# EAGLE design forkbomb19 (EAGLE 9.4.2)
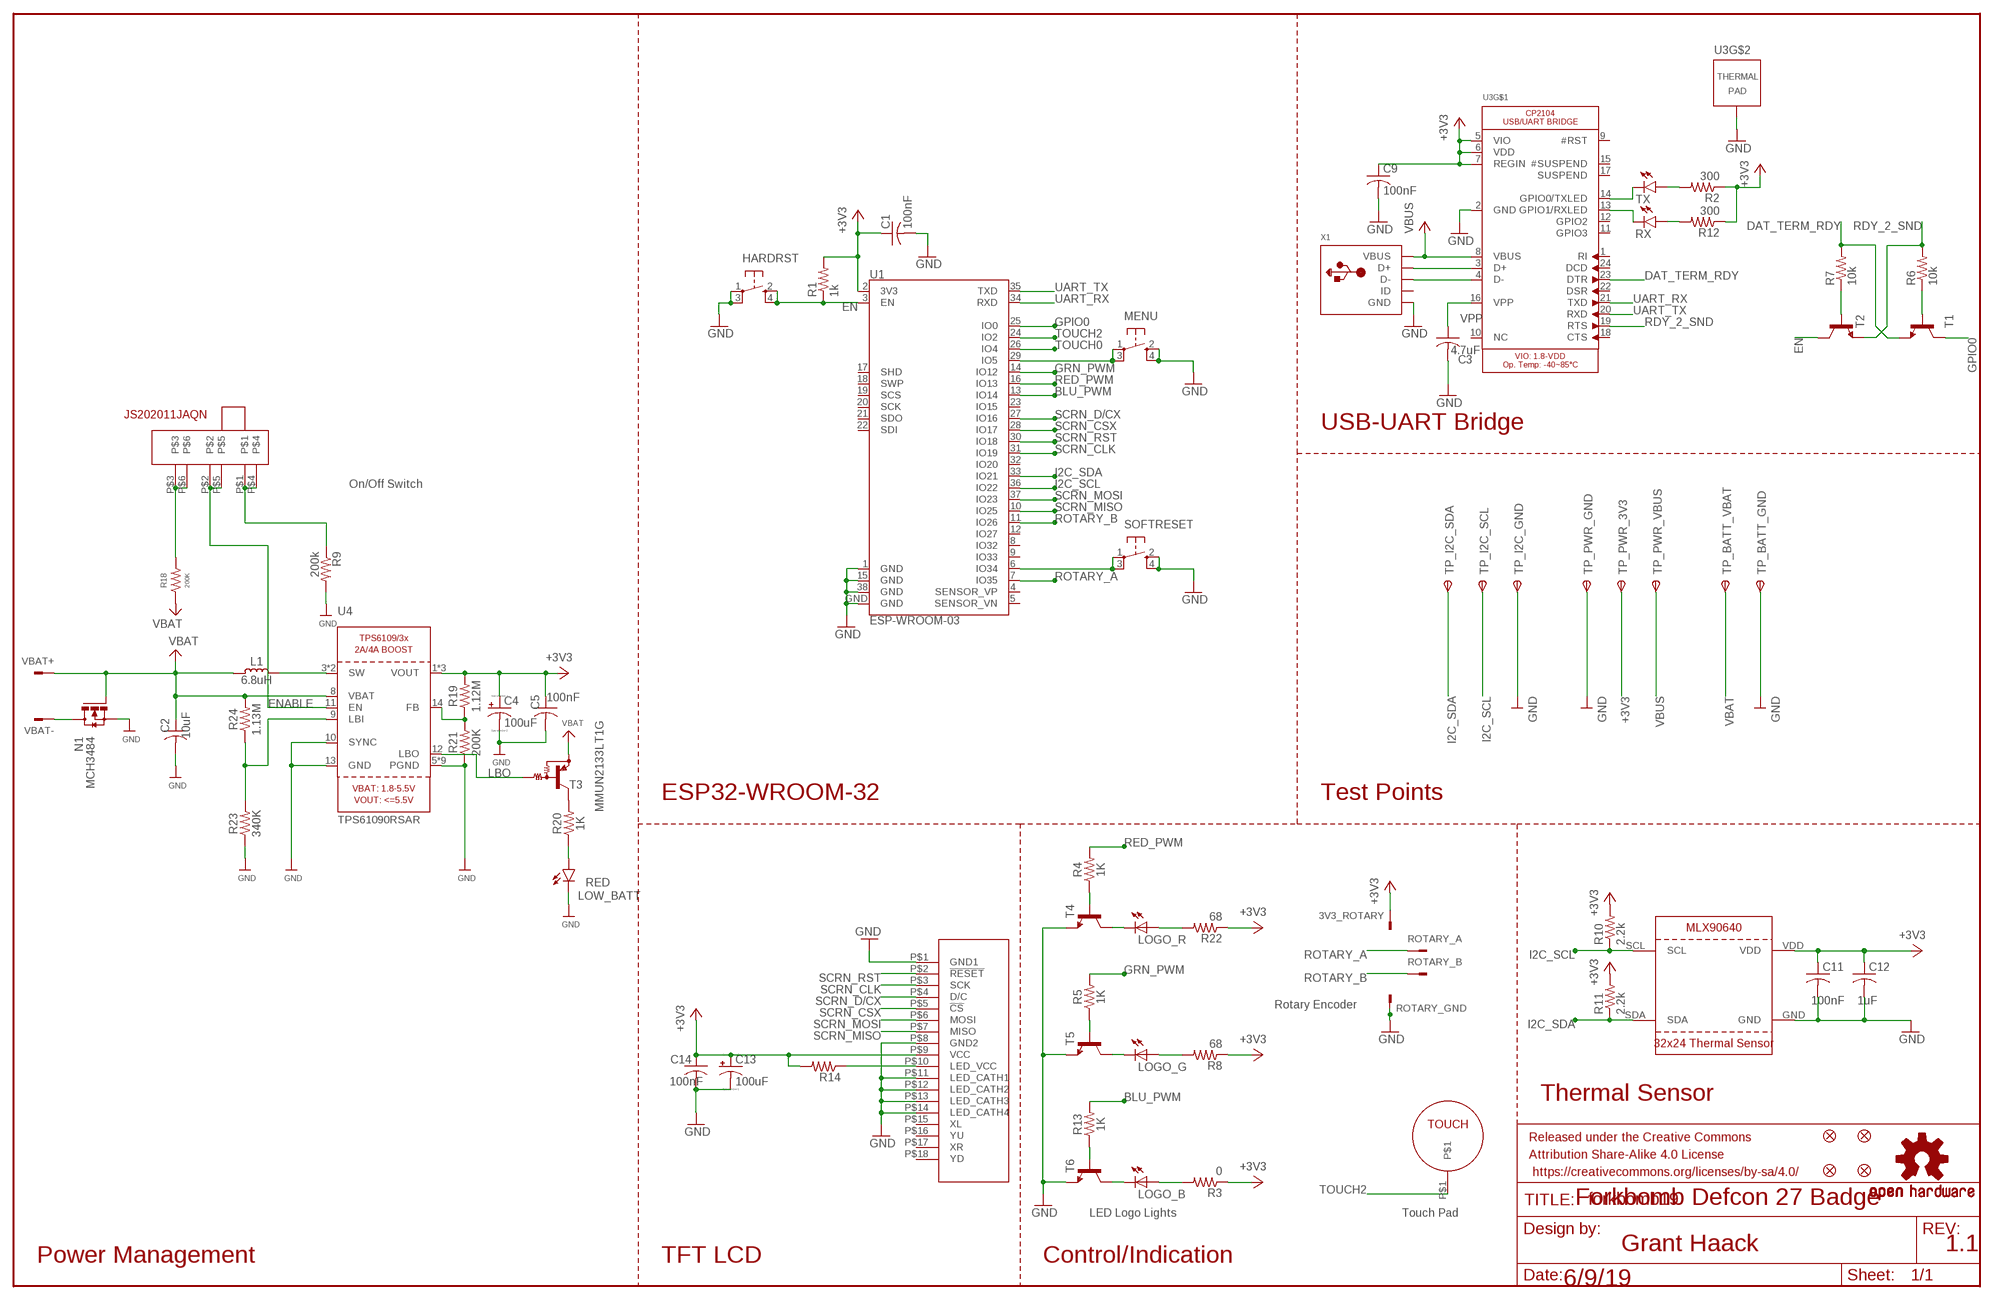
[diagram p0: schematic, sheet 1]

## Parts
3V3_ROTARY  POT_GND  TSW-101-07-G-S  [TSW-101-XX-G-S]
C1  100nF  C-USC0603  [C0603]
C2  10uF  C-USC1210  [C1210]
C3  4.7uF  C-USC0805  [C0805]
C4  100uF  CPOL-USC/6032-28R  [C/6032-28R]
C5  100nF  C-USC0603  [C0603]
C9  100nF  C-USC0603  [C0603]
C11  100nF  C-USC0603  [C0603]
C12  1uF  C-USC0805  [C0805]
C13  100uF  CPOL-USC/6032-28R  [C/6032-28R]
C14  100nF  C-USC0603  [C0603]
FID1  FIDUCIAL_1MM  [FIDUCIAL_1MM]
FID2  FIDUCIAL_1MM  [FIDUCIAL_1MM]
FID3  FIDUCIAL_1MM  [FIDUCIAL_1MM]
FID4  FIDUCIAL_1MM  [FIDUCIAL_1MM]
FRAME1  FRAME-LEDGER  [CREATIVE_COMMONS]
HARDRST  SPST_TACT-KMR2  [KMR2]
L1  6.8uH  INDUCTORTDK_VLC5045  [INDUCTOR_5X5MM_TDK_VLC5045]
LOGO1  OSHW-LOGOS-COPPER  [OSHW-LOGO-S_COPPER]
LOGO_B  REVERSE_PLCC_LED  [PLCC2_LED]
LOGO_G  REVERSE_PLCC_LED  [PLCC2_LED]
LOGO_R  REVERSE_PLCC_LED  [PLCC2_LED]
LOW_BATT  RED  LEDCHIP-LED0603  [CHIP-LED0603]
MENU  SPST_TACT-KMR2  [KMR2]
N1  MCH3484  [MCH3484]
R1  1k  R-US_R0603  [R0603]
R2  300  R-US_R0603  [R0603]
R3  0  R-US_R0805  [R0805]
R4  1K  R-US_R0603  [R0603]
R5  1K  R-US_R0603  [R0603]
R6  10k  R-US_R0603  [R0603]
R7  10k  R-US_R0603  [R0603]
R8  68  R-US_R0805  [R0805]
R9  200k  R-US_R0603  [R0603]
R10  2.2k  R-US_R0603  [R0603]
R11  2.2k  R-US_R0603  [R0603]
R12  300  R-US_R0603  [R0603]
R13  1K  R-US_R0603  [R0603]
R14  R-US_R1210  [R1210]
R18  200K  R-US_R0603  [R0603]
R19  1.12M  R-US_R0603  [R0603]
R20  1K  R-US_R0603  [R0603]
R21  200K  R-US_R0603  [R0603]
R22  68  R-US_R0805  [R0805]
R23  340K  R-US_R0603  [R0603]
R24  1.13M  R-US_R0603  [R0603]
ROTARY_A  POT_SIG  TSW-101-07-G-S  [TSW-101-XX-G-S]
ROTARY_B  POT_3V3  TSW-101-07-G-S  [TSW-101-XX-G-S]
ROTARY_GND  POT_GND  TSW-101-07-G-S  [TSW-101-XX-G-S]
RX  LEDCHIP-LED0603  [CHIP-LED0603]
SOFTRESET  SPST_TACT-KMR2  [KMR2]
T1  MMBT3904LT1-NPN-SOT23-BEC  [SOT23-BEC]
T2  MMBT3904LT1-NPN-SOT23-BEC  [SOT23-BEC]
T3  MMUN2133LT1G  MUN2114T1-PNP_DRIVER-SC59-BEC  [SC59-BEC]
T4  MMBT3904LT1-NPN-SOT23-BEC  [SOT23-BEC]
T5  MMBT3904LT1-NPN-SOT23-BEC  [SOT23-BEC]
T6  MMBT3904LT1-NPN-SOT23-BEC  [SOT23-BEC]
TOUCH  TOUCHPADTOUCH_BLANK  [TOUCH_BLANK]
TP_BATT_GND  TPSTP20SQ  [TP20SQ]
TP_BATT_VBAT  TPSTP20SQ  [TP20SQ]
TP_I2C_GND  TPSTP20SQ  [TP20SQ]
TP_I2C_SCL  TPSTP20SQ  [TP20SQ]
TP_I2C_SDA  TPSTP20SQ  [TP20SQ]
TP_PWR_3V3  TPSTP20SQ  [TP20SQ]
TP_PWR_GND  TPSTP20SQ  [TP20SQ]
TP_PWR_VBUS  TPSTP20SQ  [TP20SQ]
TX  LEDCHIP-LED0603  [CHIP-LED0603]
U1  ESP-WROOM-03  [ESP-WROOM-03]
U3  CP2104  [QFN24_4MM_SMSC]
U4  TPS61090RSAR  VREG_TPS6103X  [PVQFN-16]
U$2  SPI_TFT  [SPI_TFT]
U$7  MLX90640  [MLX90640]
U$8  JS202011JAQN  [JS202011JAQN]
VBAT+  POT_GND  TSW-101-07-G-S  [TSW-101-XX-G-S]
VBAT-  POT_GND  TSW-101-07-G-S  [TSW-101-XX-G-S]
X1  USB_MICRO_20329_V2  [4UCONN_20329_V2]

## Nets
+3V3: 3V3_ROTARY.1 C1.1 C4.+ C5.1 C9.1 C11.1 C12.1 C13.+ C14.1 R1.2 R2.1 R3.1 R8.1 R10.2 R11.2 R12.1 R14.2 R19.2 R22.1 TP_PWR_3V3.TP(PP) U1.2(3V3) U3.5(VIO) U3.6(VDD) U3.7(REGIN) U4.1(VOUT) U4.15(VOUT) U4.16(VOUT) U$2.P$9(VCC) U$7.VDD
BLU_PWM: R13.2 U1.13(IO14)
DAT_TERM_RDY: R7.2 T1.E U3.23(DTR)
EN: HARDRST.2(S) HARDRST.4(S1) R1.1 T2.C U1.3(EN)
ENABLE: U4.11(EN) U$8.P$2 U$8.P$5
GND: C1.2 C2.2 C3.2 C4.- C5.2 C9.2 C11.2 C12.2 C13.- C14.2 HARDRST.1(P) HARDRST.3(P1) LOW_BATT.C MENU.2(S) MENU.4(S1) N1.S R9.2 R21.1 R23.1 ROTARY_GND.1 SOFTRESET.2(S) SOFTRESET.4(S1) T4.E T5.E T6.E TP_BATT_GND.TP(PP) TP_I2C_GND.TP(PP) TP_PWR_GND.TP(PP) U1.1(GND) U1.15(GND) U1.38(GND) U1.GND U3.2(GND) U3.THERM(TP) U4.5(PGND) U4.6(PGND) U4.7(PGND) U4.10(SYNC) U4.13(GND) U4.P$18(PGND) U4.P$19(PGND) U4.P$20(PGND) U4.P$21(PGND) U4.P$22(PGND) U4.THERMAL(PGND) U$2.P$1(GND1) U$2.P$8(GND2) U$2.P$11(LED_CATH1) U$2.P$12(LED_CATH2) U$2.P$13(LED_CATH3) U$2.P$14(LED_CATH4) U$7.GND X1.BASE@1(GND) X1.BASE@2(GND) X1.GND X1.SPRT@1(GND) X1.SPRT@2(GND) X1.SPRT@3(GND) X1.SPRT@4(GND)
GPIO0: T1.C U1.25(IO0)
GRN_PWM: R5.2 U1.14(IO12)
I2C_SCL: R10.1 TP_I2C_SCL.TP(PP) U1.36(IO22) U$7.SCL
I2C_SDA: R11.1 TP_I2C_SDA.TP(PP) U1.33(IO21) U$7.SDA
LBO: T3.B U4.12(LBO)
MENU: MENU.1(P) MENU.3(P1) U1.29(IO5)
N$1: R14.1 U$2.P$10(LED_VCC)
N$2: SOFTRESET.1(P) SOFTRESET.3(P1) U1.6(IO34)
N$3: R18.2 U$8.P$3 U$8.P$6
N$4: LOGO_B.2(C) T6.C
N$5: U3.3(D+) X1.D+
N$6: U3.4(D-) X1.D-
N$7: LOGO_B.1(A) R3.2
N$8: LOGO_G.2(C) T5.C
N$9: LOGO_R.2(C) T4.C
N$10: R5.1 T5.B
N$11: R13.1 T6.B
N$12: LOGO_R.1(A) R22.2
N$13: R9.1 U$8.P$1 U$8.P$4
N$14: R4.1 T4.B
N$15: R7.1 T2.B
N$16: L1.P$2 U4.3(SW) U4.4(SW)
N$17: R6.1 T1.B
N$18: N1.D VBAT-.1
N$19: RX.C U3.13(GPIO1/RXLED)
N$20: TX.C U3.14(GPIO0/TXLED)
N$21: R2.2 TX.A
N$22: R12.2 RX.A
N$23: R23.2 R24.1 U4.9(LBI)
N$24: LOW_BATT.A R20.1
N$25: R19.1 R21.2 U4.14(FB)
N$26: R20.2 T3.C
N$31: LOGO_G.1(A) R8.2
RDY_2_SND: R6.2 T2.E U3.19(RTS)
RED_PWM: R4.2 U1.16(IO13)
ROTARY_A: ROTARY_A.1 U1.7(IO35)
ROTARY_B: ROTARY_B.1 U1.11(IO26)
SCRN_CLK: U1.31(IO19) U$2.P$3(SCK)
SCRN_CSX: U1.28(IO17) U$2.P$5(!CS)
SCRN_D/CX: U1.27(IO16) U$2.P$4(D/C)
SCRN_MISO: U1.10(IO25) U$2.P$7(MISO)
SCRN_MOSI: U1.37(IO23) U$2.P$6(MOSI)
SCRN_RST: U1.30(IO18) U$2.P$2(!RESET)
TOUCH0: U1.26(IO4)
TOUCH2: TOUCH.P$1 U1.24(IO2)
UART_RX: U1.34(RXD) U3.21(TXD)
UART_TX: U1.35(TXD) U3.20(RXD)
VBAT: C2.1 L1.P$1 N1.G R18.1 R24.2 T3.E TP_BATT_VBAT.TP(PP) U4.8(VBAT) VBAT+.1
VBUS: TP_PWR_VBUS.TP(PP) U3.8(VBUS) X1.VBUS
VPP: C3.1 U3.16(VPP)
Unconnected: U1.4(SENSOR_VP) U1.5(SENSOR_VN) U1.8(IO32) U1.9(IO33) U1.12(IO27) U1.17(SHD) U1.18(SWP) U1.19(SCS) U1.20(SCK) U1.21(SDO) U1.22(SDI) U1.23(IO15) U1.32(IO20) U3.1(RI) U3.9(#RST) U3.10(NC) U3.11(GPIO3) U3.12(GPIO2) U3.15(#SUSPEND) U3.17(SUSPEND) U3.18(CTS) U3.22(DSR) U3.24(DCD) U$2.P$15(XL) U$2.P$16(YU) U$2.P$17(XR) U$2.P$18(YD) X1.ID

## Notes on the sheet
- USB-UART Bridge
- On/Off Switch
- ESP32-WROOM-32 | Test Points
- Rotary Encoder
- Thermal Sensor
- Forkbomb Defcon 27 Badge
- LED Logo Lights | Touch Pad
- Grant Haack | 1.1
- Power Management | TFT LCD | Control/Indication
- 6/9/19

## Library data of the parts
3V3_ROTARY ROTARY_A ROTARY_B ROTARY_GND VBAT+ VBAT- = con-samtec:TSW-101-*-G-S: THROUGH-HOLE .025" SQ POST HEADER Source: Samtec TSW.pdf; MF: Samtec Inc.; MPN: TSW-101-07-G-S
C1 C9 C11 C12 C14 = resistor:C-US: CAPACITOR, American symbol
C2 C3 C5 = rcl:C-US: CAPACITOR, American symbol; SPICEPREFIX: C
C4 C13 = resistor:CPOL-US: POLARIZED CAPACITOR, American symbol
FID1-FID4 = forkbomb19:FIDUCIAL: Fiducial Alignment Points Various fiducial points for machine vision alignment.; BOM: EXCLUDE
FRAME1 = SparkFun-Aesthetics:FRAME-LEDGER: Schematic Frame - Ledger Standard 11x14 US Ledger frame
HARDRST MENU SOFTRESET = adafruit:SPST_TACT: SMT 6mm switch, EVQQ2 series http://www.ladyada.net/library/eagle
L1 = microbuilder:INDUCTOR: Inductors 0603: 10nH Ceramic Inductor - microwire antenna/RF (Digikey: 712-1434-2-ND) 0805: 560nH Ceramic Inductor - RF (Digikey: 553-1047-1-ND) 270nH Ceramic Inductor - Q = 40@250MHz, +-5%, 1 Ohm DC Resistance (Digikey: 535-10506-2-ND) 1007 (2518 Metric) SMT: 10µH 10% 250mOhm 820mA 1007 Inductor (Digikey: 587-2189-1-ND) 22µH 10% 500mOhm 580mA 1007 Inductor (Digikey: 587-2190-1-ND) 47µH 10% 950mOhm 420mA 1007 Inductor (Digikey: 587-2191-1-ND) 47µH 5% 100mOhm 1A 1008 Inductor (Digikey: 732-1816-1-ND) 5.0x5.0mm (Taiyo Yuden NR5040 Series) 6.8µH 20% 2.3A 64mOhm Inductor (Digikey: 587-2374-2-ND) 5.0x5.0mm (TDK VLC5045 Series) 4.7µH 20% 3.3A 34mOhm Inductor (Digikey: 445-6526-1-ND) 6.8µH 20% 2.7A 46mOhm Inductor (Digikey: 445-6527-1-ND) 6.0x6.0mm (TDK VLC6045 Series) 4.7µH 20% 3.8A 27mOhm Inductor (Digikey: 445-6538-2-ND) 6.8µH 20% 3A 41mOhm Inductor (Digikey: 445-6540-1-ND) 6.2µH 30% 2.2A 45mOhm Inductor (Digikey: SRR5028-6R2YCT-ND) - Not TDK VLC6045 but footprint should match 6.0x6.0mm (TDK SLF6045 Series) 6.8uH 30% 2A 33mOhm Inductor (Digikey: 445-4572-1-ND, Mouser: 810-SLF645T6R8N2R0PF) 6.0x6.0mm (Sumida CDRH5D28 Series) 6.2uH 30% 1.8A 45mOhm Inductor (Digikey: 308-1542-1-ND) Taiyo Yuden NR3015T2R2M - 2.2uH 20% 1.5A (Digikey: 587-1648-2-ND, Mouser: 963-NR3015T2R2M) - Used with TI TPS62172 CoilCraft RFID Transponder Coil - MA5532-AE (For use with AS3935 Lightning Sensor) Vishay IHLP 1.0uH Molded Inductor - 24mOhm DCR, 5A, +/-20%, -55°C-125°C (Digikey: 541-1319-1-ND)
LOGO1 = SparkFun-Aesthetics:OSHW-LOGO: Open-Source Hardware (OSHW) Logo This logo indicates the piece of hardware it is found on incorporates a OSHW license and/or adheres to the definition of open source hardware found here: http://freedomdefined.org/OSHW
LOGO_B LOGO_G LOGO_R = forkbomb19:REVERSE_PLCC_LED
LOW_BATT RX TX = led:LED: LED OSRAM: - CHIPLED LG R971, LG N971, LY N971, LG Q971, LY Q971, LO R971, LY R971 LH N974, LH R974 LS Q976, LO Q976, LY Q976 LO Q996 - Hyper CHIPLED LW Q18S LB Q993, LB Q99A, LB R99A - SideLED LS A670, LO A670, LY A670, LG A670, LP A670 LB A673, LV A673, LT A673, LW A673 LH A674 LY A675 LS A676, LA A676, LO A676, LY A676, LW A676 LS A679, LY A679, LG A679 - Hyper Micro SIDELED® LS Y876, LA Y876, LO Y876, LY Y876 LT Y87S - SmartLED LW L88C, LW L88S LB L89C, LB L89S, LG L890 LS L89K, LO L89K, LY L89K LS L896, LA L896, LO L896, LY L896 - TOPLED LS T670, LO T670, LY T670, LG T670, LP T670 LSG T670, LSP T670, LSY T670, LOP T670, LYG T670 LG T671, LOG T671, LSG T671 LB T673, LV T673, LT T673, LW T673 LH T674 LS T676, LA T676, LO T676, LY T676, LB T676, LH T676, LSB T676, LW T676 LB T67C, LV T67C, LT T67C, LS T67K, LO T67K, LY T67K, LW E67C LS E67B, LA E67B, LO E67B, LY E67B, LB E67C, LV E67C, LT E67C LW T67C LS T679, LY T679, LG T679 LS T770, LO T770, LY T770, LG T770, LP T770 LB T773, LV T773, LT T773, LW T773 LH T774 LS E675, LA E675, LY E675, LS T675 LS T776, LA T776, LO T776, LY T776, LB T776 LHGB T686 LT T68C, LB T68C - Hyper Mini TOPLED® LB M676 - Mini TOPLED Santana® LG M470 LS M47K, LO M47K, LY M47K Source: http://www.osram.convergy.de LUXEON: - LUMILED® LXK2-PW12-R00, LXK2-PW12-S00, LXK2-PW14-U00, LXK2-PW14-V00 LXK2-PM12-R00, LXK2-PM12-S00, LXK2-PM14-U00 LXK2-PE12-Q00, LXK2-PE12-R00, LXK2-PE12-S00, LXK2-PE14-T00, LXK2-PE14-U00 LXK2-PB12-K00, LXK2-PB12-L00, LXK2-PB12-M00, LXK2-PB14-N00, LXK2-PB14-P00, LXK2-PB14-Q00 LXK2-PR12-L00, LXK2-PR12-M00, LXK2-PR14-Q00, LXK2-PR14-R00 LXK2-PD12-Q00, LXK2-PD12-R00, LXK2-PD12-S00 LXK2-PH12-R00, LXK2-PH12-S00 LXK2-PL12-P00, LXK2-PL12-Q00, LXK2-PL12-R00 Source: www.luxeon.com KINGBRIGHT: KA-3528ASYC Source: www.kingbright.com
N1 = forkbomb19:MCH3484
R1-R3 R6-R8 R10-R12 R22 = resistor:R-US_: RESISTOR, American symbol
R4 R5 R9 R13 R14 R18-R21 R23 R24 = rcl:R-US_: RESISTOR, American symbol; SPICEPREFIX: R
T1 T2 T4-T6 = transistor:*-NPN-: NPN Transistror BF959 corrected 2008.03.06
T3 = transistor:*-PNP_DRIVER-: PNP Bias Resistor Transistor
TOUCH = forkbomb19:TOUCHPAD
TP_BATT_GND TP_BATT_VBAT TP_I2C_GND TP_I2C_SCL TP_I2C_SDA TP_PWR_3V3 TP_PWR_GND TP_PWR_VBUS = testpad:TPS: TEST PIN
U1 = forkbomb19:ESP-WROOM-03
U3 = forkbomb19:CP2104: CP2104 - USB to UART Bridge VDD Output: 3.45V
U4 = microbuilder:VREG_TPS6103X: TPS6103x 4A Boost - 1.8-5.5V Input, Adjustable Output to 5.5V
U$2 = forkbomb19:SPI_TFT
U$7 = forkbomb19:MLX90640
U$8 = forkbomb19:JS202011JAQN
X1 = forkbomb19:USB: USB Connectors USBMINIB - Surface Mount Female Mini-B USB Connector 4UConnector: 06564

## Board
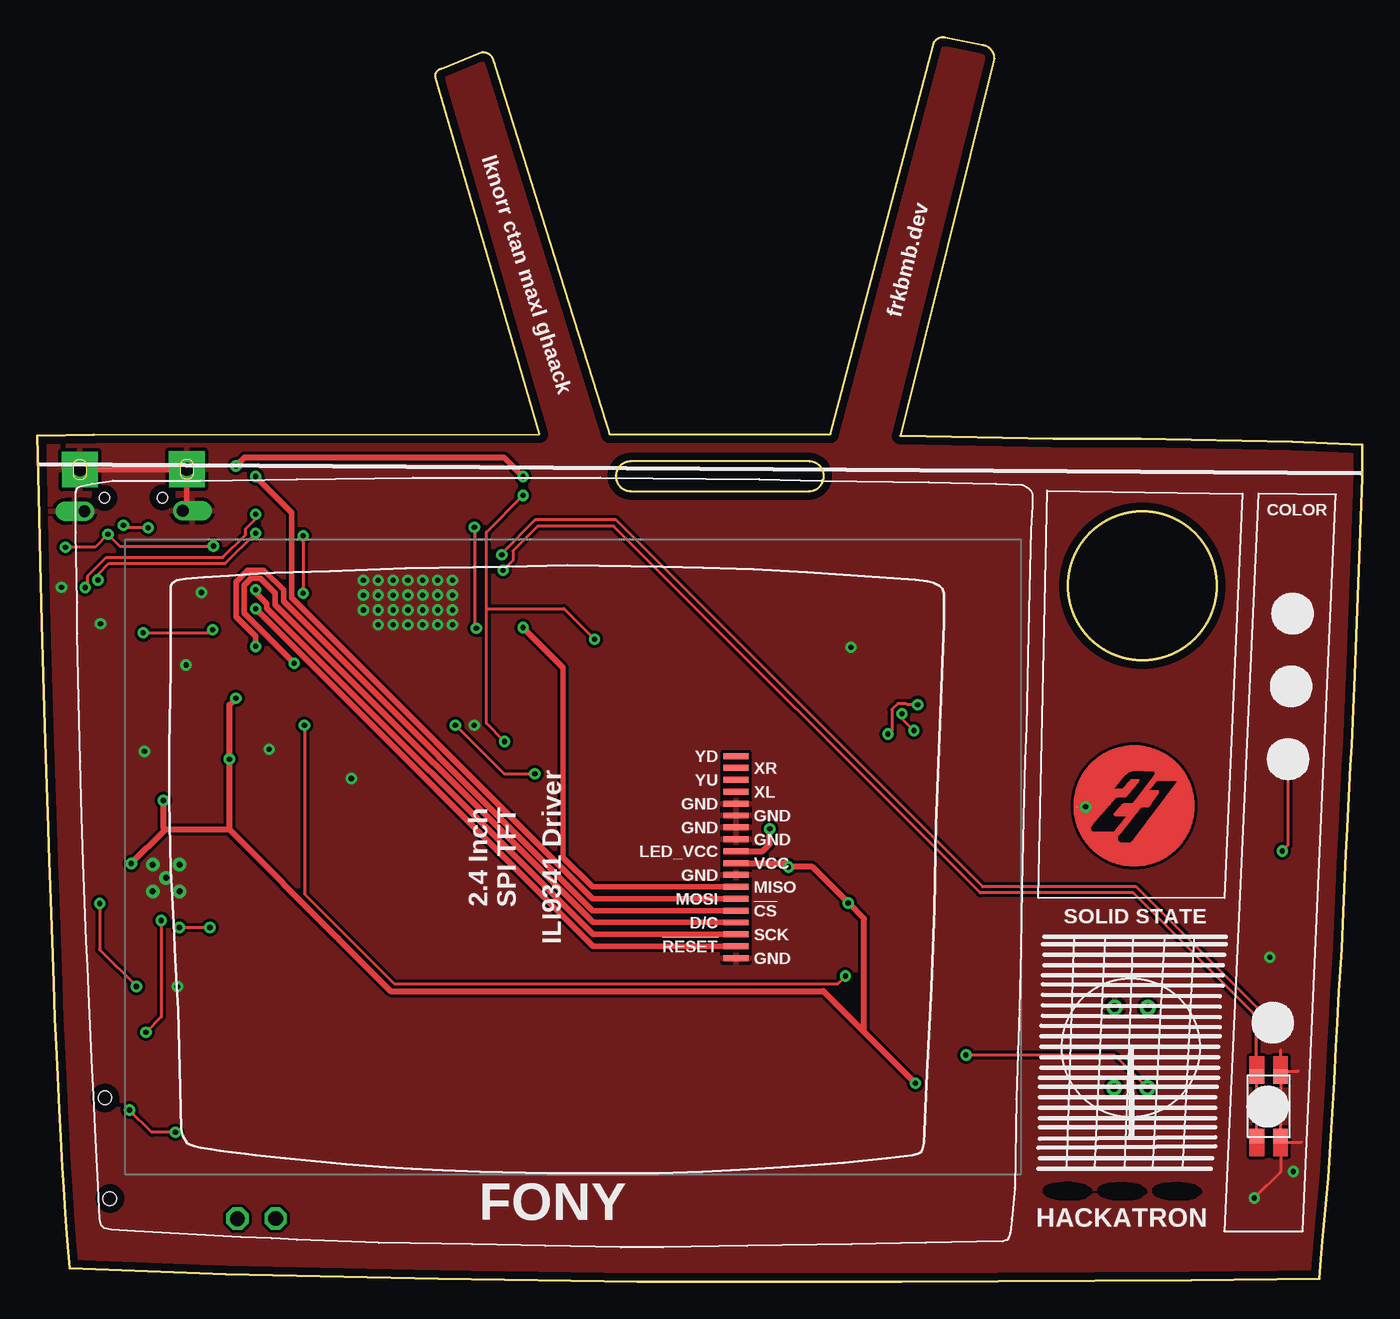
[diagram p1: board, top side]
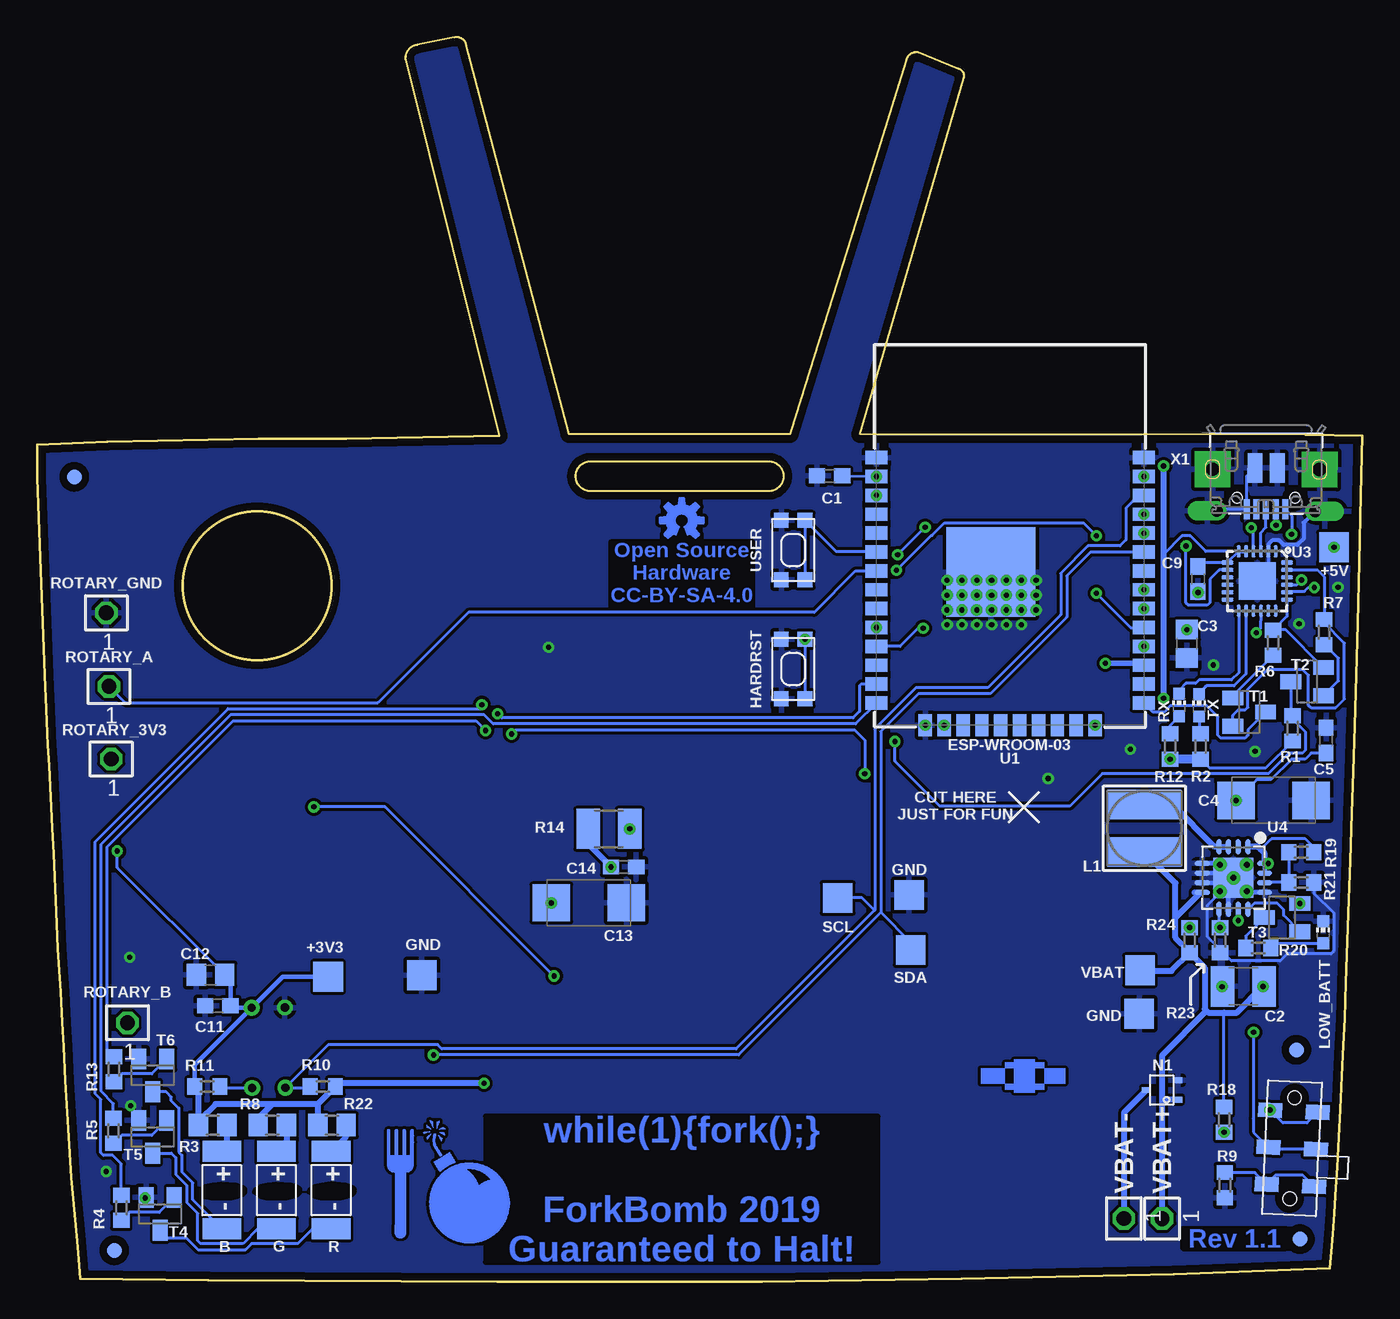
[diagram p2: board, bottom side, seen from below]

Size 89.2 x 83.73 mm. Coordinates in mm from the lower left corner, seen from the top.
Outline: 2.2,0.9 2.1,2 2,3.2 1.9,4.6 1.8,6.3 1.7,7.7 1.6,9.7 1.5,11.6 1.4,13.8 1.3,15.9 1.2,17.7 1.1,20.1 0.9,25.7 0.8,28.3 0.7,31.5 0.6,34.3 0.5,37.4 0.4,40.8 0.3,44.3 0.2,48.4 0.1,52.9 0,56.9 3.81,56.97 33.81,57.02 26.81,81.02 arc-90 27.21,81.62 29.91,82.72 arc-90 30.71,82.12 38.51,57.02 53.41,57.02 60.31,83.22 arc-90 61.11,83.72 63.61,83.22 arc-90 64.41,82.22 58.11,56.92 68.41,56.72 74.3,56.7 84.5,56.5 89.2,56.3 89.2,54.1 89,48.7 88.8,43.5 88.7,40.8 88.6,38.5 88.5,36.1 88.4,34.7 88.2,30.5 88.1,28.8 87.9,24.9 87.8,22.4 87.7,20.9 87.6,19.5 87.5,17.4 87.4,15.8 87.3,13.5 87.1,10.3 86.9,7 86.6,3.8 86.5,2.7 86.4,1.5 86.3,0.2 77.7,0.1 58.2,0 40.4,0 27,0.2 12.7,0.5 2.2,0.9
Outline: 39.95,55.19 arc90 38.95,54.19 arc90 39.95,53.19 51.95,53.19 arc90 52.95,54.19 arc90 51.95,55.19 39.95,55.19
Outline: circle at 74.38,46.82 radius 5
Copper layers (1*16): Top 0.035mm / dielectric 1.5mm / Bottom 0.035mm
Design rules "default *": minimum track width 8mil, minimum drill 0.35mm, track to track 8mil, track to pad 8mil, pad to pad 8mil, via to via 8mil, smd to smd 0mil, copper to edge 20mil, drill to drill 8mil, minimum pad ring 10mil, minimum via ring 8mil, stop-mask expansion 4mil, vias tented up to drill 0mil, thermal gap 10mil
tKeepout: area 75.2,5.6 to 78.3,6.6; area 71.5,5.6 to 74.6,6.6; area 67.8,5.6 to 70.9,6.6
bKeepout: area 75.2,5.6 to 78.3,6.6; area 71.5,5.6 to 74.6,6.6; area 67.8,5.6 to 70.9,6.6
tRestrict: area 75.2,5.6 to 78.3,6.6; area 67.8,5.6 to 70.9,6.6; area 71.5,5.6 to 74.6,6.6
bRestrict: area 75.2,5.6 to 78.3,6.6; area 71.5,5.6 to 74.6,6.6; area 67.8,5.6 to 70.9,6.6

### Footprints (pad centres in the part's own frame; a part is rotated, then mirrored left to right if it is on the bottom)
TSW-101-XX-G-S = drill 1 pad 1.5 octagon: 1 0,0
C0603 = smd 1.1 x 1: 1 -0.85,0; 2 0.85,0
C1210 = smd 1.6 x 2.7: 1 -1.4,0; 2 1.4,0
C0805 = smd 1.3 x 1.5: 1 -0.95,0; 2 0.95,0
C/6032-28R = smd 2.55 x 2.5: + 2.525,0; - -2.525,0
FIDUCIAL_1MM = smd 1 x 1: 1 0,0
KMR2 = smd 1 x 1: 1 2,0.8; 2 2,-0.8; 3 -2,0.8; 4 -2,-0.8
INDUCTOR_5X5MM_TDK_VLC5045 = smd 2 x 5: P$1 -1.6,0; P$2 1.6,0
PLCC2_LED = smd 1.4 x 2.6: 1 -2.6,0; 2 2.6,0
CHIP-LED0603 = smd 0.8 x 0.8: A 0,-0.75; C 0,0.75
MCH3484 = smd 0.4 x 0.6: D 0,1.05; G -0.65,-1.05; S 0.65,-1.05
R0603 = smd 1 x 1.1: 1 -0.85,0; 2 0.85,0
R0805 = smd 1.3 x 1.5: 1 -0.95,0; 2 0.95,0
R1210 = smd 1.6 x 2.7: 1 -1.4,0; 2 1.4,0
SOT23-BEC = smd 1 x 1.4: B -0.95,-1.1; C 0,1.1; E 0.95,-1.1
SC59-BEC = smd 1 x 1.4: B -0.95,-1.2; C 0,1.2; E 0.95,-1.2
TOUCH_BLANK = smd 0.025 x 0.025: P$1 0,0
TP20SQ = smd 2 x 2: TP 0,0
ESP-WROOM-03 = smd 0.9 x 1.5: 1 7.7,9; 2 6.43,9; 3 5.16,9; 4 3.89,9; 5 2.62,9; 6 1.35,9; 7 0.08,9; 8 -1.19,9; 9 -2.46,9; 10 -3.73,9; 11 -5,9; 12 -6.27,9; 13 -7.54,9; 14 -8.81,9; 25 -8.81,-9; 26 -7.54,-9; 27 -6.27,-9; 28 -5,-9; 29 -3.73,-9; 30 -2.46,-9; 31 -1.19,-9; 32 0.08,-9; 33 1.35,-9; 34 2.62,-9; 35 3.89,-9; 36 5.16,-9; 37 6.43,-9; 38 7.7,-9 | smd 1.5 x 0.9: 15 -10.3,5.715; 16 -10.3,4.445; 17 -10.3,3.175; 18 -10.3,1.905; 19 -10.3,0.635; 20 -10.3,-0.635; 21 -10.3,-1.905; 22 -10.3,-3.175; 23 -10.3,-4.445; 24 -10.3,-5.715 | smd 6 x 6: GND 0,1.3
QFN24_4MM_SMSC = smd 0.8 x 0.28: 1 -2,1.25; 2 -2,0.75; 3 -2,0.25; 4 -2,-0.25; 5 -2,-0.75; 6 -2,-1.25; 13 2,-1.25; 14 2,-0.75; 15 2,-0.25; 16 2,0.25; 17 2,0.75; 18 2,1.25 | smd 0.28 x 0.8: 7 -1.25,-2; 8 -0.75,-2; 9 -0.25,-2; 10 0.25,-2; 11 0.75,-2; 12 1.25,-2; 19 1.25,2; 20 0.75,2; 21 0.25,2; 22 -0.25,2; 23 -0.75,2; 24 -1.25,2 | smd 2.5 x 2.5: THERM 0,0
PVQFN-16 = smd 1.05 x 0.35: 1 -2.1,0.975; 2 -2.1,0.325; 3 -2.1,-0.325; 4 -2.1,-0.975; 9 2.1,-0.975; 10 2.1,-0.325; 11 2.1,0.325; 12 2.1,0.975 | smd 0.35 x 1.05: 5 -0.975,-2.1; 6 -0.325,-2.1; 7 0.325,-2.1; 8 0.975,-2.1; 13 0.975,2.1; 14 0.325,2.1; 15 -0.325,2.1; 16 -0.975,2.1 | drill 0.4: P$18 0,0; P$19 -0.9,0.9; P$20 0.9,0.9; P$21 0.9,-0.9; P$22 -0.9,-0.9 | smd 2.7 x 2.7: THERMAL 0,0
SPI_TFT = smd 0.4 x 1.7: P$1 -6.8,0; P$2 -6,0; P$3 -5.2,0; P$4 -4.4,0; P$5 -3.6,0; P$6 -2.8,0; P$7 -2,0; P$8 -1.2,0; P$9 -0.4,0; P$10 0.4,0; P$11 1.2,0; P$12 2,0; P$13 2.8,0; P$14 3.6,0; P$15 4.4,0; P$16 5.2,0; P$17 6,0; P$18 6.8,0
MLX90640 = drill 0.55: GND 2.07,2.06; SCL -2.92,0; SDA -2.07,-2.06; VDD 2.92,0
JS202011JAQN = smd 1 x 1.6: P$1 -2.5,1.6; P$2 0,1.6; P$3 2.5,1.6; P$4 -2.5,-1.6; P$5 0,-1.6; P$6 2.5,-1.6 | hole 0.9: -3.4,0; 3.4,0
4UCONN_20329_V2 = smd 1 x 2: BASE@1 -0.75,-2; BASE@2 0.75,-2 | smd 0.4 x 1.35: D+ 0,0.775; D- -0.65,0.775; GND 1.3,0.775; ID 0.65,0.775; VBUS -1.3,0.775 | drill 0.8 pad 1.143 offset: SPRT@1 -3.3,0.9; SPRT@2 3.3,0.9 | drill 0.9 pad 2.413 square: SPRT@3 -3.6,-1.9; SPRT@4 3.6,-1.9 | hole 0.7: -1.95,0; 1.95,0

### Placement (x,y rotation side)
3V3_ROTARY  84.21,35.17 0 bottom
C1  35.86,54.22 180 bottom
C2  8.01,19.86 180 bottom
C3  11.81,42.92 270 bottom
C4  5.98,32.37 180 bottom
C5  2.44,36.41 90 bottom
C9  11.06,47.27 270 bottom
C11  77.04,18.57 180 bottom
C12  77.53,20.64 180 bottom
C13  52.07,25.48 180 bottom
C14  49.73,27.9 0 bottom
FID1  4.2,2.86 180 bottom
FID2  84.01,2.1 180 bottom
FID3  86.7,54.14 180 bottom
FID4  4.44,15.6 180 bottom
FRAME1  18.66,-11.54 0 top  (outside the outline)
HARDRST  38.31,41.22 90 bottom
L1  14.67,30.5 90 bottom
LOGO1  45.81,51.22 0 bottom
LOGO_B  76.77,6.16 270 bottom
LOGO_G  73.09,6.16 270 bottom
LOGO_R  69.41,6.16 270 bottom
LOW_BATT  2.64,23.5 0 bottom
MENU  82.89,11.8 90 top
N1  13.48,12.89 90 bottom
R1  4.7,37.22 270 bottom
R2  10.89,36 90 bottom
R3  77.38,10.53 0 bottom
R4  83.53,4.97 90 bottom
R5  84.06,10.15 90 bottom
R6  6.01,42.98 90 bottom
R7  2.58,43.7 90 bottom
R8  73.37,10.53 0 bottom
R9  9.26,6.49 270 bottom
R10  69.97,13.13 0 bottom
R11  77.75,13.12 180 bottom
R12  12.94,36 90 bottom
R13  84.04,14.29 90 bottom
R14  50.7,30.46 180 bottom
R18  9.31,10.89 270 bottom
R19  4.11,28.89 0 bottom
R20  7.01,22.44 180 bottom
R21  4.11,26.86 180 bottom
R22  69.36,10.53 0 bottom
R23  9.57,22.97 90 bottom
R24  11.63,22.97 270 bottom
ROTARY_A  84.37,40.05 0 bottom
ROTARY_B  83.12,17.41 0 bottom
ROTARY_GND  84.55,45 0 bottom
RX  12.33,38.8 0 bottom
SOFTRESET  38.31,49.22 270 bottom
T1  7.61,38.32 270 bottom
T2  3.72,40.37 90 bottom
T3  5.41,24.49 90 bottom
T4  80.91,4.56 180 bottom
T5  81.42,9.74 180 bottom
T6  81.42,13.88 180 bottom
TOUCH  69.99,31.93 0 top
TP_BATT_GND  15.02,18.02 0 bottom
TP_BATT_VBAT  14.97,20.95 0 bottom
TP_I2C_GND  30.51,26.02 0 bottom
TP_I2C_SCL  35.31,25.82 0 bottom
TP_I2C_SDA  30.41,22.32 0 bottom
TP_PWR_3V3  69.61,20.52 0 bottom
TP_PWR_GND  63.31,20.62 0 bottom
TP_PWR_VBUS  1.91,49.42 0 bottom
TX  10.99,38.77 0 bottom
U1  23.7,47.74 90 bottom
U3  7.08,47.13 270 bottom
U4  8.68,27.16 270 bottom
U$2  47.04,28.56 90 top
U$7  73.62,15.74 67.2 top
U$8  4.73,8.97 87.3 bottom
VBAT+  13.48,4.24 90 bottom
VBAT-  16.05,4.25 90 bottom
X1  6.48,52.75 179.8 bottom

### Tracks (layer width: path | path; a pad name or v marks a point on that pad's centre or on a via)
+3V3  (via drill 0.35)
  Top 0.203: 3V3_ROTARY.1 84.21,29.38 v83.8,28.97
  Top 0.305: 20.16,23.1 20.16,23.19 20.27,23.08
  Top 0.406: 20.16,23.19 12.94,30.41 | 12.94,30.41 R12.1 12.94,38.83 v13.37,39.26 | v13.37,54.88 13.96,55.46 31.41,55.46 U1.2 | v59.12,13.35 55.67,16.8 | 55.67,16.8 52.92,19.55 23.8,19.55 20.27,23.08 | v6.34,28.14 8.5,30.3 | 8.5,30.3 8.61,30.41 | 12.94,30.41 8.61,30.41 | 8.61,30.41 8.5,30.51 | 8.5,30.51 C4.+ | 8.5,30.51 8.5,30.3 | 55.67,16.8 55.67,24.41 C13.+ 52.17,27.9 C14.1 50.31,28.16 U$2.P$9
  Bottom 0.203: C9.1 10.8,48.39 U3.7 U3.6 10.54,49.14 11.58,50.18 12.15,50.18 13.37,48.95 | C1.1 32.73,54.19 U1.2 | R2.1 10.31,34.58 6.49,34.58 R1.2 | 6.84,29.08 6.12,29.79 3.83,29.79 3.26,29.23 R19.2 | C12.1 83.8,27.86 v83.8,28.97 | 8.13,32.37 C4.+ | 8.5,33.08 C4.+ | C5.1 3.45,35.56 3.85,35.16 4.76,35.16 6.15,33.77 7.11,33.77 C4.+
  Bottom 0.254: R14.2 52.1,29.43 52.09,29.42
  Bottom 0.279: U3.6 U3.5
  Bottom 0.305: U4.15 U4.16 v6.34,28.14 | U$7.VDD 78.6,14.59 R11.2 | U$7.VDD 76.05,18.43 C11.1 76.19,20.25 C12.1 | v59.12,13.35 68.9,13.35 R10.2 69.19,13.13 | TP_PWR_3V3.TP 72.67,20.52 U$7.VDD
  Bottom 0.406: U4.16 6.58,28.82 6.84,29.08 7.02,29.26 U4.1 | v59.12,13.35 68.97,13.35 69.19,13.13 | R3.1 78.33,10.81 | 78.33,10.81 78.33,12.85 R11.2 | R10.2 70.31,11.95 | 70.31,11.95 R22.1 | 70.31,11.95 73.37,11.95 | R8.1 74.32,11 73.37,11.95 | 73.37,11.95 77.2,11.95 78.33,10.81 | v13.37,39.26 13.37,48.95 v13.37,54.88 | C14.1 52.09,29.42
  Bottom 0.61: R2.1 R12.1
  other vias: 12.94,35.15 32.7,54.17 54.59,25.48 50.58,27.9 8.5,32.37
BLU_PWM  (via drill 0.35)
  Top 0.203: v59.01,37.08 58.21,37.88 v58.21,38.21
  Bottom 0.203: R13.2 84.49,15.59 84.49,29.26 76.01,37.73 59.66,37.73 v59.01,37.08 | U1.13 33.74,40.2 33.84,40.09 33.84,38.37 34.28,37.94 57.94,37.94 v58.21,38.21
DAT_TERM_RDY
  Bottom 0.203: U3.23 3.03,47.89 2.55,47.41 2.55,44.71 2.58,44.69 R7.2 2.58,44.33 1.21,42.96 1.21,39.2 1.79,38.61 3.45,38.61 3.62,38.79 3.62,40.8 3.99,41.17 6.39,41.17 7.71,39.86 7.71,38.65 7.89,38.47 8.35,38.47 8.71,38.11 T1.E
EN  (via drill 0.35)
  Top 0.203: U1.3 30.24,50.44 30.24,45.28 | v31.46,36.34 30.24,37.55 30.24,45.28 | 30.24,45.28 35.45,45.28 HARDRST.2
  Bottom 0.203: 4.82,40.32 T2.C 4.82,38.2 R1.1 4.7,37.85 3.84,37 3.84,35.75 4.02,35.57 4.93,35.57 6.32,34.18 17.51,34.18 19.69,31.99 28.44,31.99 31.46,35.01 v31.46,36.34 | HARDRST.2 HARDRST.4
  other vias: 32.7,52.9 37.51,43.22
ENABLE  (via drill 0.35)
  Top 0.203: v8.36,24.29 8.36,17.8 v7.33,16.78
  Bottom 0.203: v7.33,16.78 7.33,11.25 7.34,10.97 7.33,10.96 7.33,10.05 U$8.P$2 6.18,8.9 U$8.P$5 | U4.11 v8.36,24.29
GND  (via drill 0.35)
  Top 0.203: MENU.4 83.69,7.39 v81.93,5.63 | MENU.2 83.69,14.03 | MENU.2 83.69,15.6 | MENU.2 84.06,14.16 84.88,14.16 | MENU.2 83.69,12.65 83.63,12.59 | MENU.4 84.11,9.39 85.1,9.39 | MENU.4 83.69,10.67 83.66,10.71
  Top 0.356: X1.SPRT@3 10.05,54.63 X1.SPRT@4 10.08,52.15 X1.SPRT@2
  Bottom 0.203: U3.THERM 6.23,47.14 6.19,47.18 6.33,47.32 U3.2 6.33,49.31 | X1.SPRT@2 9.67,51.98 X1.GND 7.79,54.19 X1.BASE@2 | 9.01,27.49 8.38,26.86 9.34,25.89 9.86,25.89 10.43,25.32 10.43,23.19 8.81,21.58 5.53,21.58 5.06,22.05 2.11,22.05 1.93,22.23 1.93,24.8 3.26,26.13 R21.1
  Bottom 0.254: X1.SPRT@1 3.95,51.07 3.95,49.99 4.37,49.57 5.3,49.57 5.59,49.87 6.07,49.87 6.33,49.6 6.33,49.31
  Bottom 0.305: U4.13 7.71,26.19 U4.P$18 | U4.7 9.01,26.84 | U4.6 9.01,27.49 | U4.5 9.66,28.14 9.01,27.49 | 9.01,27.49 U4.P$18 | U4.10 9.01,26.84 | 9.01,26.84 U4.P$18
  other vias: 11.06,46.37 29.42,37.44 27.95,47.19 26.95,47.19 25.95,47.19 24.95,47.19 23.95,47.19 22.95,47.19 21.95,47.19 21.95,46.19 22.95,46.19 23.95,46.19 24.95,46.19 25.95,46.19 26.95,46.19 27.95,46.19 27.95,45.19 26.95,45.19 25.95,45.19 24.95,45.19 23.95,45.19 22.95,45.19 21.95,45.19 22.95,44.19 23.95,44.19 24.95,44.19 25.95,44.19 26.95,44.19 27.95,44.19 10.02,41.49 7.23,35.67 4.26,44.26 9.44,19.85 54.78,42.69 15.61,35.83 21.15,33.85 84.55,7.4 82.89,11.82 1.64,46.72 82.97,21.83
  pour Top: -1.05,-0.81 -1.05,86.39 90.95,86.39 90.95,-0.81
  pour Bottom: -2.05,-0.81 -2.05,87.49 91.95,87.49 91.95,-0.81
GPIO0
  Bottom 0.203: U1.25 14.1,38.32 13.34,38.32 12.91,38.75 10.47,38.75 9.72,38 9.72,36.75 9.54,36.57 7.89,36.57 7.71,36.75 7.71,37.13 T1.C
GRN_PWM
  Bottom 0.203: R5.2 84.06,11.98 84.89,12.81 84.89,29.43 76.18,38.14 59.1,38.14 58.49,37.53 34.11,37.53 U1.14
I2C_SCL
  Bottom 0.203: 31.65,38.35 | 31.65,38.35 30.04,39.97 25.21,39.97 20.31,44.87 20.31,47.66 18.47,49.5 16.32,49.5 15.92,49.9 15.92,52.05 15.07,52.9 U1.36 | 31.65,38.35 32.81,37.19 32.81,25.01 32.84,24.99 | 32.84,24.99 42.16,15.66 61.96,15.66 62.24,15.94 69.6,15.94 U$7.SCL 70.91,13.04 R10.1 | 32.84,24.99 33.67,25.82 TP_I2C_SCL.TP
I2C_SDA  (via drill 0.35)
  Top 0.203: v62.52,15.25 72.5,15.25 U$7.SDA
  Bottom 0.203: U1.33 18.3,49.09 19.9,47.49 19.9,44.7 25.04,39.56 29.87,39.56 31.24,38.19 | 31.24,38.19 | 31.24,38.19 32.41,37.02 32.41,24.84 | v62.52,15.25 41.99,15.25 32.41,24.84 | R11.1 76.81,13.03 U$7.SDA | 32.41,24.84 30.41,22.84 TP_I2C_SDA.TP
LBO
  Bottom 0.203: U4.12 7.64,24.99 7.61,25.02 7.61,25.12 7.27,25.46 5.74,25.46 5.3,25.03 5.3,24.64 T3.B
MENU  (via drill 0.35)
  Top 0.203: MENU.3 MENU.1 82.06,13.83 82.06,17.86 73.78,26.15 63.49,26.15 38.8,50.84 33.69,50.84 32.02,49.17 32.02,48.53 v31.36,47.87 | v17.9,50.18 v17.9,46.32
  Bottom 0.203: v17.9,50.18 18.77,51.05 28.13,51.05 28.96,50.22 29.01,50.22 v31.36,47.87 | v17.9,46.32 15.59,44.01 U1.29
N$1  (via drill 0.35)
  Top 0.406: U$2.P$10 48.83,28.96 49.3,29.44 R14.1
  other vias: 49.3,30.46
N$2
  Bottom 0.203: U1.6 32.76,49.15 35.44,49.15 SOFTRESET.3 SOFTRESET.1
N$3  (via drill 0.35)
  Top 0.203: R18.2 7.71,10.04 U$8.P$3
  Bottom 0.203: U$8.P$6 3.73,10.68 5.35,10.68 U$8.P$3
  other vias: 6.21,11.54 9.31,10.04
N$4
  Bottom 0.203: LOGO_B.2 78.73,5.51 78.73,6.64 79.4,7.31 79.46,7.38 79.46,8.51 79.67,8.71 79.67,11.67 80.17,12.17 80.17,12.42 80.53,12.78 T6.C
N$5
  Bottom 0.203: U3.3 6.83,50.4 6.49,50.74 X1.D+
N$6  (via drill 0.35)
  Top 0.203: v7.48,50.72 5.97,50.72 v5.8,50.89
  Bottom 0.203: U3.4 7.33,50.57 v7.48,50.72 | v5.8,50.89 5.84,50.92 5.84,51.91 | 5.84,51.91 X1.D- | X1.D- 5.84,51.91 | X1.D-
N$7
  Bottom 0.406: R3.2 76.43,9.1 LOGO_B.1
N$8
  Bottom 0.203: LOGO_G.2 74.34,3.56 75.35,2.56 78.2,2.56 78.38,2.73 78.38,4.59 79.13,5.35 79.13,6.47 79.87,7.21 79.87,8.34 80.17,8.64 T5.C
N$9
  Bottom 0.203: LOGO_R.2 70.66,3.56 71.66,2.56 74.77,2.56 75.18,2.15 78.37,2.15 79.18,2.96 80.41,2.96 T4.C
N$10
  Bottom 0.203: T5.B 81.48,9.84 83.52,9.84 R5.1
N$11
  Bottom 0.203: T6.B 81.48,13.98 83.5,13.98 R13.1
N$12
  Bottom 0.406: R22.2 68.41,9.76 LOGO_R.1
N$13
  Bottom 0.203: U$8.P$4 4,7.15 5.84,7.15 U$8.P$1 7.23,7.34 R9.1
N$14
  Bottom 0.203: T4.B 80.97,4.66 82.99,4.66 R4.1
N$15
  Bottom 0.203: T2.B 1.61,40.42 1.61,41.95 2.52,42.85 R7.1
N$16
  Bottom 0.305: 9.18,29.26 U4.3
  Bottom 0.406: L1.P$2 12.8,32.1 9.96,29.26 U4.4 9.18,29.26
N$17
  Bottom 0.203: R6.1 8.71,39.43 T1.B
N$18
  Bottom 0.406: N1.D 16.05,11.37 VBAT-.1
N$19
  Bottom 0.203: RX.C 12.33,39.79 11.87,40.25 11.21,40.25 10.98,40.48 8.81,40.48 8.33,40.96 U3.13
N$20
  Bottom 0.203: TX.C 10.49,40.08 8.64,40.08 7.83,40.89 U3.14
N$21
  Bottom 0.203: TX.A 10.99,36.96 R2.2
N$22
  Bottom 0.203: RX.A 12.94,37.41 R12.2
N$23  (via drill 0.35)
  Top 0.203: R24.1 R23.2
  Bottom 0.203: U4.9 9.66,23.91 R23.2
  other vias: 11.63,23.82 9.57,23.82
N$24
  Bottom 0.203: LOW_BATT.A 2.92,22.74 5.85,22.74 R20.1
N$25
  Bottom 0.203: U4.14 6.56,26.86 R21.2 R19.1
N$26
  Bottom 0.203: T3.C 7.86,23.24 R20.2
N$31
  Bottom 0.406: R8.2 72.42,9.43 LOGO_G.1
RDY_2_SND
  Bottom 0.203: U3.19 5.08,44.76 5.97,43.87 | 5.97,43.87 R6.2 | T2.E 5.17,43.87 5.97,43.87
RED_PWM  (via drill 0.35)
  Top 0.203: U1.16 31.41,34.18 v33.5,34.18 | v57.27,36.85 57.3,36.85 57.53,37.08 57.53,38.5 57.93,38.9 58.49,38.9 58.57,38.82 v59.27,38.82
  Bottom 0.203: v57.27,36.85 57.27,36.87 57.01,37.12 34.18,37.12 33.5,36.44 v33.5,34.18 | v59.27,38.82 59.27,38.55 76.35,38.55 85.3,29.59 85.3,12.64 84.92,12.26 84.92,8.67 84.74,8.49 84.11,8.49 83.53,7.91 R4.2
  other vias: 28.15,37.44
ROTARY_A
  Bottom 0.203: U1.7 34.11,47.82 36.89,45.03 60.17,45.03 66.26,38.95 83.27,38.95 ROTARY_A.1
ROTARY_B  (via drill 0.35)
  Top 0.203: ROTARY_B.1 73.98,26.56 63.66,26.56 38.97,51.25 33.52,51.25 31.28,49.01 v31.28,48.91 | v29.43,50.76 29.43,44.08 v29.56,43.96
  Bottom 0.203: v31.28,48.91 v29.43,50.76 | v29.56,43.96 29.91,43.96 31.12,42.74 U1.11
SCRN_CLK  (via drill 0.35)
  Top 0.356: U1.31 14.7,46.35 15.46,45.6 15.46,45.31 37.41,23.36 U$2.P$3
  other vias: 14.71,46.55
SCRN_CSX  (via drill 0.35)
  Top 0.356: U1.28 14.7,43.42 13.39,44.73 13.39,47.1 14.16,47.87 15.25,47.87 16.58,46.54 16.58,45.77 37.39,24.96 U$2.P$5
  other vias: 14.71,42.74
SCRN_D/CX  (via drill 0.35)
  Top 0.356: U$2.P$4 37.4,24.16 16.02,45.54 16.02,46.31 15.02,47.31 14.39,47.31 13.95,46.87 13.95,44.97 v17.3,41.61
  Bottom 0.356: v17.3,41.61 14.84,41.61 U1.27
SCRN_MISO  (via drill 0.35)
  Top 0.356: U$2.P$7 37.37,26.56 35.41,28.53 35.41,41.3 U1.10
  other vias: 32.7,44.01
SCRN_MOSI  (via drill 0.35)
  Top 0.356: U$2.P$6 37.38,25.76 17.14,46.01 17.14,51.74 U1.37
  other vias: 14.71,54.17
SCRN_RST  (via drill 0.35)
  Top 0.356: U$2.P$2 37.42,22.56 U1.30
  other vias: 14.71,45.28
TOUCH2  (via drill 0.35)
  Top 0.203: U1.24 17.99,26.08 24.01,20.05 53.89,20.05 v54.4,20.56 | v70.58,31.94 v70.56,31.93 TOUCH.P$1
  Bottom 0.203: v54.4,20.56 65.78,31.94 v70.58,31.94
  other vias: 17.99,37.44
UART_RX  (via drill 0.35)
  Top 0.203: v4.1,47.2 4.1,47.59 4.83,48.33 12.67,48.33 U1.34
  Bottom 0.203: U3.21 4.42,46.89 v4.1,47.2
  other vias: 14.71,50.36
UART_TX  (via drill 0.35)
  Top 0.203: v3.24,46.71 3.42,46.88 3.42,47.49 4.66,48.73 12.5,48.73 14.02,50.25 14.02,50.64 14.7,51.33 U1.35
  Bottom 0.203: U3.20 5.02,46.44 3.89,46.44 3.63,46.71 v3.24,46.71
  other vias: 14.71,51.63
VBAT  (via drill 0.35)
  Top 0.203: T3.E 4.21,22.34 v6.69,19.86
  Bottom 0.203: R18.1 9.31,18.1
  Bottom 0.305: 10.82,26.19 U4.8 11.23,26.19
  Bottom 0.406: 11.3,26.19 U4.8 10.89,26.19 12.59,24.49 | 12.59,24.49 12.59,23.15 11.63,22.2 R24.2 | R24.2 10.62,21.11 10.62,18.34 10.49,18.21 | 10.49,18.21 10.38,18.1 9.31,18.1 8.44,18.1 v6.69,19.86 C2.1 | 12.59,24.49 12.59,26.82 L1.P$1 | TP_BATT_VBAT.TP 14.92,20.9 12.85,20.9 R24.2 | VBAT+.1 13.48,12.23 | 13.48,12.23 13.48,15.23 10.49,18.21 | N1.G 13.47,12.24 13.48,12.23
  other vias: 4.21,25.44
VBUS  (via drill 0.35)
  Top 0.203: TP_PWR_VBUS.TP 3.9,49.42 v4.76,50.28 5.55,49.49 v11.86,49.49
  Bottom 0.203: U3.8 9.62,47.89 10.26,47.25 10.26,45.69 10.44,45.51 11.69,45.51 11.87,45.69 v11.87,49.49 v11.86,49.49 | X1.VBUS 4.76,51.54 v4.76,50.28
  other vias: 1.91,49.42
VPP  (via drill 0.35)
  Top 0.203: v7.15,43.65 11.6,43.65 C3.1
  Bottom 0.203: U3.16 6.83,44.49 6.86,44.46 6.86,43.94 v7.15,43.65
  other vias: 11.81,43.87
(copper drawn outside any net)
  shapes: Bottom area x1014, Top area x677

### Text on the board
Bottom: Open Source / Hardware / CC-BY-SA-4.0 | while(1){fork();} / / ForkBomb 2019 / Guaranteed to Halt! | Rev 1.1
tPlace: COLOR | SOLID STATE | FONY | HACKATRON
bPlace: +5V | CUT HERE / JUST FOR FUN | GND | SCL | GND | +3V3 | VBAT | SDA | GND
tNames: lknorr ctan maxl ghaack | frkbmb.dev
bNames: USER | ROTARY_GND | ROTARY_A | HARDRST | ROTARY_3V3 | ROTARY_B | R | G | B
tDocu: Grant Haack